# EAGLE design 6packRev4A (EAGLE 9.2.0)
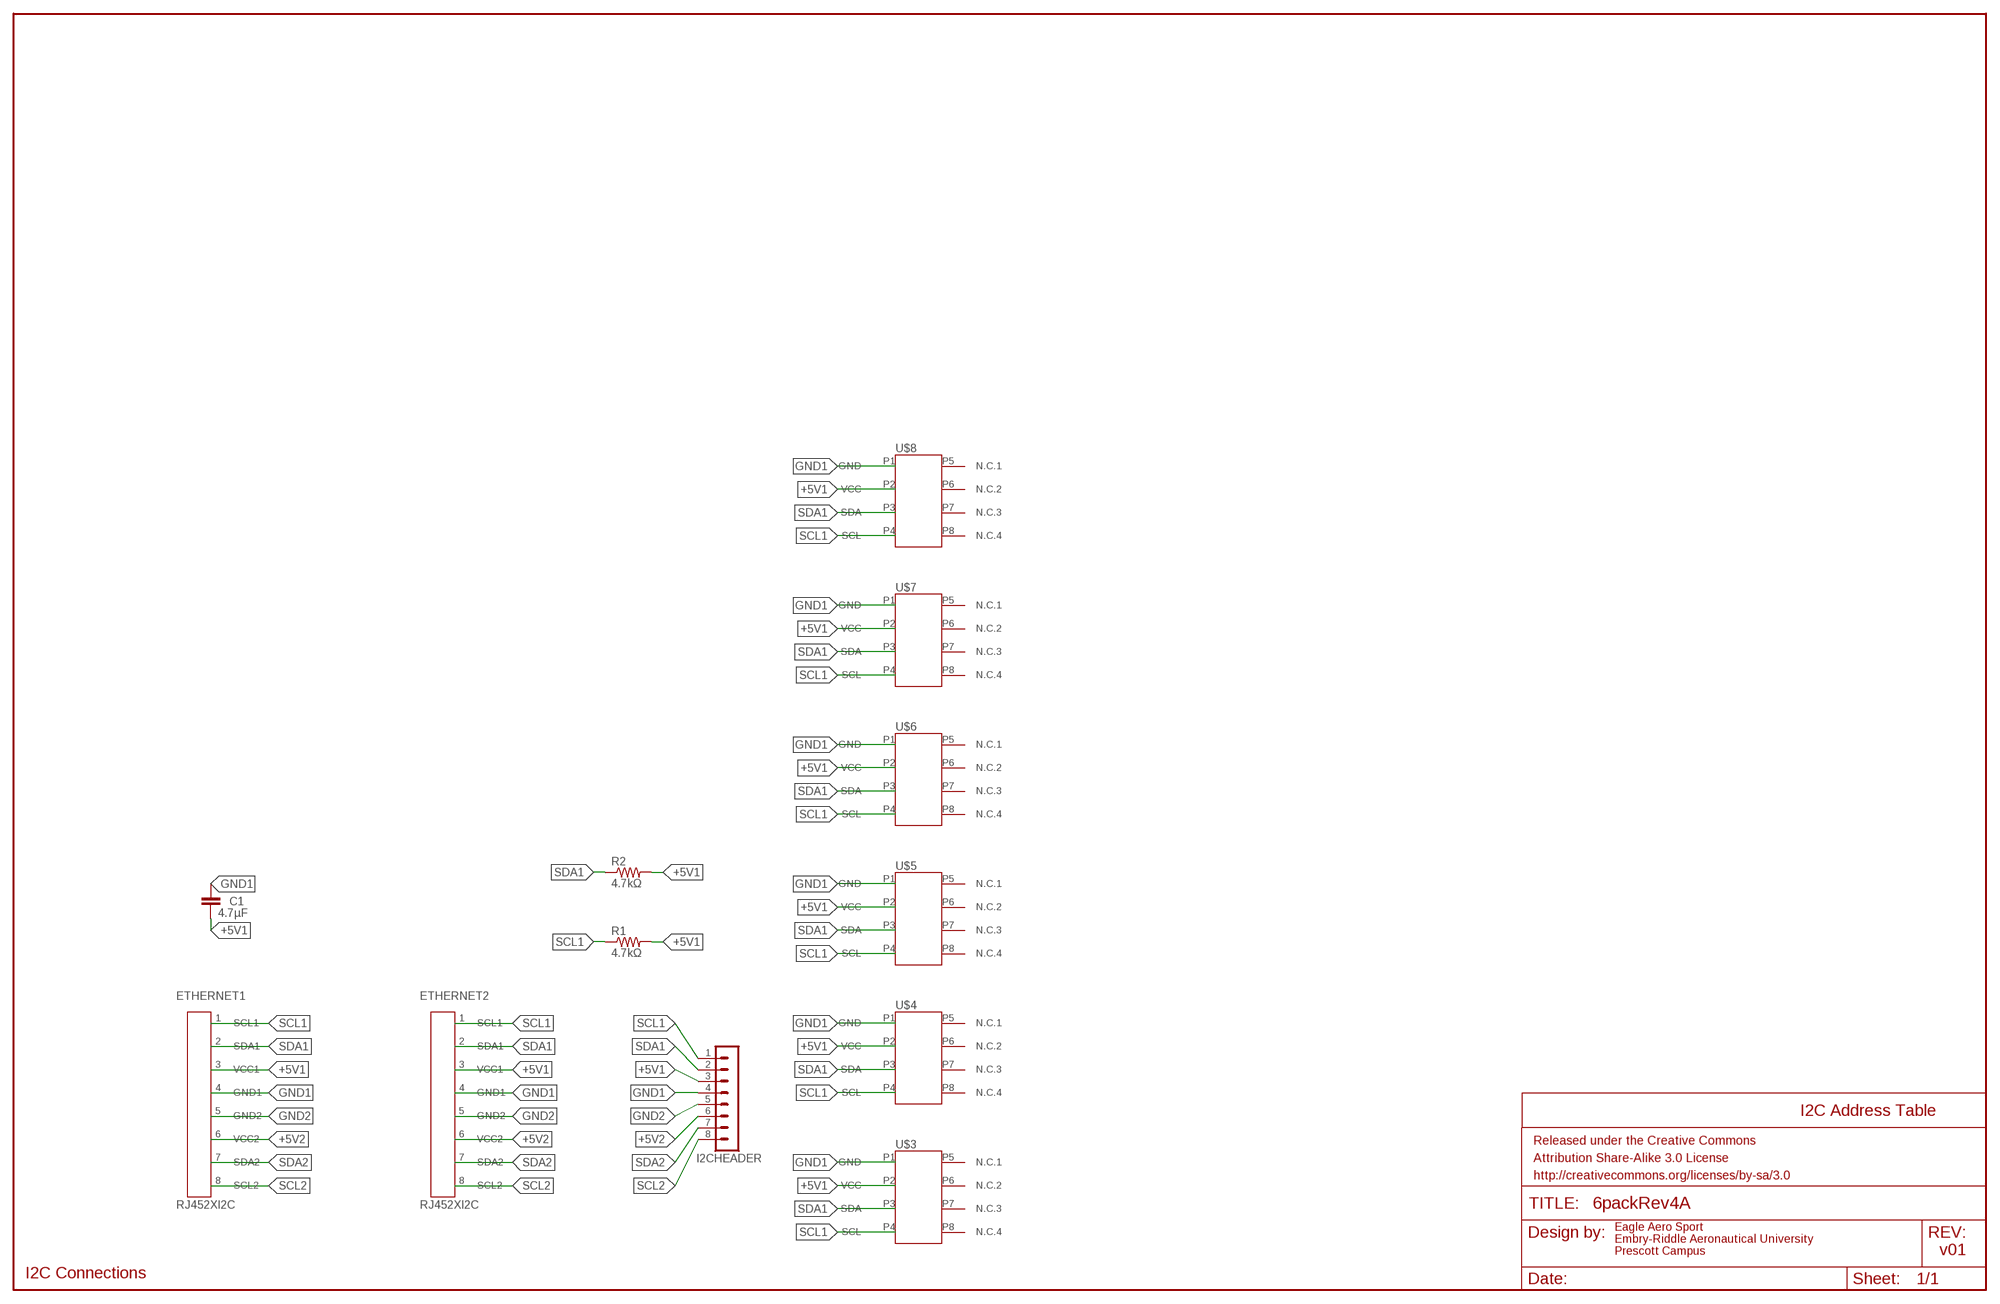
[diagram p0: schematic, sheet 1]

## Parts
C1  4.7µF  10NF-PTH-10MM-10000V-1-%  [CAP-PTH-10MM]
ETHERNET1  RJ452XI2C  [RJ45-8]
ETHERNET2  RJ452XI2C  [RJ45-8]
FRAME1  FRAME-LEDGER  [CREATIVE_COMMONS]
I2CHEADER  MA08-1  [MA08-1]
R1  4.7kΩ  R-US_0207/12  [0207/12]
R2  4.7kΩ  R-US_0207/12  [0207/12]
U$3  AMS5915  [DIP8W]
U$4  AMS5915  [DIP8W]
U$5  AMS5915  [DIP8W]
U$6  AMS5915  [DIP8W]
U$7  AMS5915  [DIP8W]
U$8  AMS5915  [DIP8W]

## Nets
+5V1 [Power]: C1.2 ETHERNET1.3(VCC1) ETHERNET2.3(VCC1) I2CHEADER.3 R1.2 R2.2 U$3.P2(VCC) U$4.P2(VCC) U$5.P2(VCC) U$6.P2(VCC) U$7.P2(VCC) U$8.P2(VCC)
+5V2 [Power]: ETHERNET1.6(VCC2) ETHERNET2.6(VCC2) I2CHEADER.6
GND1 [Power]: C1.1 ETHERNET1.4(GND1) ETHERNET2.4(GND1) I2CHEADER.4 U$3.P1(GND) U$4.P1(GND) U$5.P1(GND) U$6.P1(GND) U$7.P1(GND) U$8.P1(GND)
GND2 [Power]: ETHERNET1.5(GND2) ETHERNET2.5(GND2) I2CHEADER.5
SCL1: ETHERNET1.1(SCL1) ETHERNET2.1(SCL1) I2CHEADER.1 R1.1 U$3.P4(SCL) U$4.P4(SCL) U$5.P4(SCL) U$6.P4(SCL) U$7.P4(SCL) U$8.P4(SCL)
SCL2: ETHERNET1.8(SCL2) ETHERNET2.8(SCL2) I2CHEADER.8
SDA1: ETHERNET1.2(SDA1) ETHERNET2.2(SDA1) I2CHEADER.2 R2.1 U$3.P3(SDA) U$4.P3(SDA) U$5.P3(SDA) U$6.P3(SDA) U$7.P3(SDA) U$8.P3(SDA)
SDA2: ETHERNET1.7(SDA2) ETHERNET2.7(SDA2) I2CHEADER.7
Unconnected: U$3.P5(N.C.1) U$3.P6(N.C.2) U$3.P7(N.C.3) U$3.P8(N.C.4) U$4.P5(N.C.1) U$4.P6(N.C.2) U$4.P7(N.C.3) U$4.P8(N.C.4) U$5.P5(N.C.1) U$5.P6(N.C.2) U$5.P7(N.C.3) U$5.P8(N.C.4) U$6.P5(N.C.1) U$6.P6(N.C.2) U$6.P7(N.C.3) U$6.P8(N.C.4) U$7.P5(N.C.1) U$7.P6(N.C.2) U$7.P7(N.C.3) U$7.P8(N.C.4) U$8.P5(N.C.1) U$8.P6(N.C.2) U$8.P7(N.C.3) U$8.P8(N.C.4)

## Notes on the sheet
- I2C Address Table
- Eagle Aero Sport
  Embry-Riddle Aeronautical University
  Prescott Campus
- v01
- I2C Connections

## Library data of the parts
C1 = SparkFun-Capacitors:10NF: 0.01uF/10nF/10,000pF ceramic capacitors A capacitor is a passive two-terminal electrical component used to store electrical energy temporarily in an electric field. CAP-09321; PROD_ID: CAP-09321; VALUE: 10nF
ETHERNET1 ETHERNET2 = untitled:RJ452XI2C
FRAME1 = SparkFun-Aesthetics:FRAME-LEDGER: Schematic Frame Standard 11x14 US Ledger frame
I2CHEADER = con-lstb:MA08-1: PIN HEADER; OC_FARNELL: unknown; OC_NEWARK: unknown
R1 R2 = resistor:R-US_: RESISTOR, American symbol
U$3-U$8 = untitled:AMS5915

## Net classes
0 default: width 0.254 mm, clearance 0.254 mm
1 Power: width 0.762 mm, clearance 0.762 mm

## Board
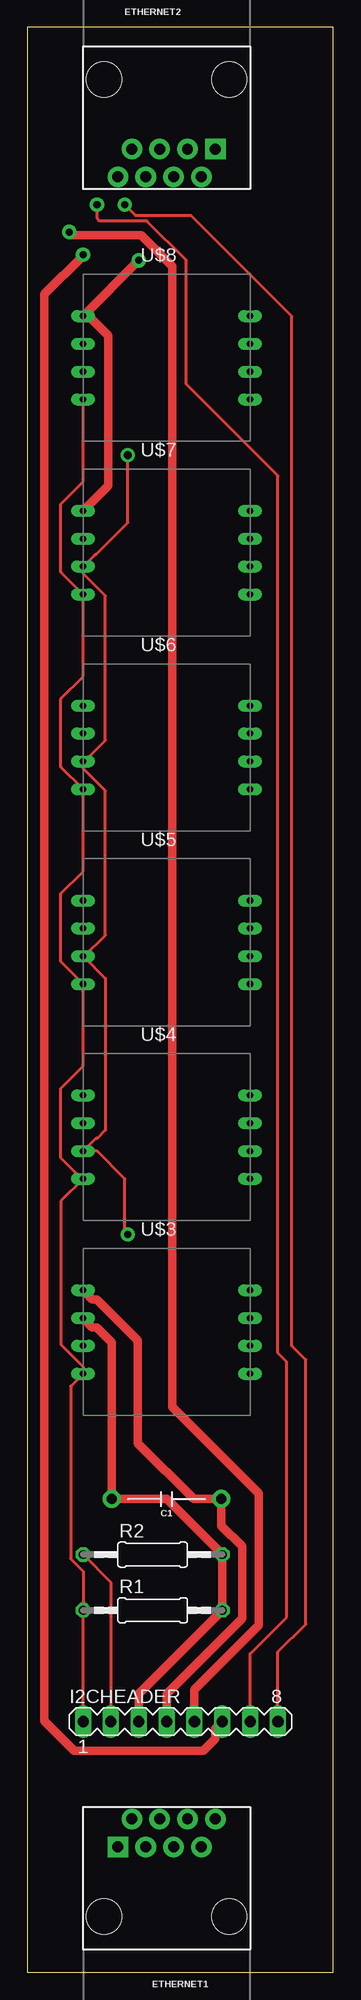
[diagram p1: board, top side]
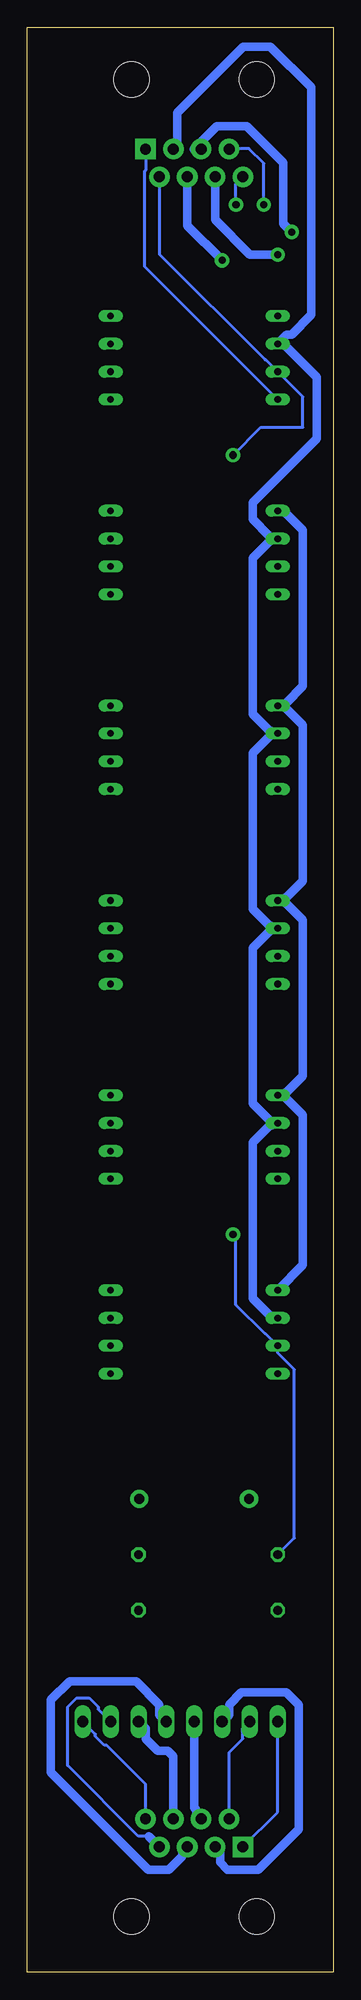
[diagram p2: board, bottom side, seen from below]

Size 27.92 x 177.47 mm. Coordinates in mm from the lower left corner, seen from the top.
Outline: 0,0 27.92,0 27.92,177.47 0,177.47 0,0
Copper layers (1*16): Top 0.035mm / dielectric 1.5mm / Bottom 0.035mm
Design rules "6packRev4A": minimum track width 6mil, minimum drill 0.35mm, track to track 0.205mm, track to pad 0.205mm, pad to pad 0.205mm, via to via 0.205mm, smd to smd 6mil, copper to edge 40mil, drill to drill 6mil, minimum pad ring 10mil, minimum via ring 8mil, stop-mask expansion 4mil, vias tented up to drill 0mil, thermal gap 10mil

### Footprints (pad centres in the part's own frame; a part is rotated, then mirrored left to right if it is on the bottom)
CAP-PTH-10MM = drill 0.9 pad 1.651: 1 -5,0; 2 5,0
RJ45-8 = drill 1 pad 1.88 square: 1 -4.445,6.35 | drill 1 pad 1.88: 2 -3.175,8.89; 3 -1.905,6.35; 4 -0.635,8.89; 5 0.635,6.35; 6 1.905,8.89; 7 3.175,6.35; 8 4.445,8.89 | hole 3.2: -5.715,0; 5.715,0
MA08-1 = drill 1.016 long: 1 -8.89,0; 2 -6.35,0; 3 -3.81,0; 4 -1.27,0; 5 1.27,0; 6 3.81,0; 7 6.35,0; 8 8.89,0
0207/12 = drill 0.813 octagon: 1 -6.35,0; 2 6.35,0
DIP8W = drill 0.6 long: P1 -7.62,3.81; P2 -7.62,1.27; P3 -7.62,-1.27; P4 -7.62,-3.81; P5 7.62,-3.81; P6 7.62,-1.27; P7 7.62,1.27; P8 7.62,3.81

### Placement (x,y rotation side)
C1  12.7,43.18 180 top
ETHERNET1  12.7,5.08 0 top
ETHERNET2  12.7,172.72 180 top
FRAME1  -77.47,62.23 0 top  (outside the outline)
I2CHEADER  13.97,22.86 0 top
R1  11.43,33.02 0 top
R2  11.43,38.1 0 top
U$3  12.7,58.42 0 top
U$4  12.7,76.2 0 top
U$5  12.7,93.98 0 top
U$6  12.7,111.76 0 top
U$7  12.7,129.54 0 top
U$8  12.7,147.32 0 top

### Tracks (layer width: path | path; a pad name or v marks a point on that pad's centre or on a via)
+5V1
  Top 0.762: I2CHEADER.3 10.16,25.4 R1.2 R2.2 12.7,43.18 C1.2 7.7,57.48 6.34,58.85 5.92,58.85 U$3.P2
  Bottom 0.762: ETHERNET1.3 10.34,10.97 10.34,10.02 9.67,9.35 6.84,9.35 3.17,13.01 3.17,24.41 4.29,25.53 8.41,25.53 9.53,24.41 9.53,23.5 I2CHEADER.3 | ETHERNET2.3 14.27,166.71 14.27,169.67 8.23,175.72 5.74,175.72 2.02,171.99 2.02,151.24 3.82,149.43 4.24,149.43 U$8.P2 4.57,148.59 1.52,145.54 1.52,139.95 7.37,134.11 7.37,132.59 5.84,131.06 U$7.P2 5.59,130.81 7.37,129.03 7.37,114.81 5.84,113.28 U$6.P2 5.59,113.03 7.37,111.25 7.37,97.03 5.84,95.5 U$5.P2 5.59,95.25 7.37,93.47 7.37,79.25 5.59,77.47 U$4.P2 5.84,77.22 7.37,75.69 7.37,61.47 5.59,59.69 U$3.P2
+5V2  (via drill 0.65 pad 1.3)
  Top 0.762: I2CHEADER.6 17.14,22.23 17.14,21.31 16.03,20.19 4.29,20.19 1.56,22.93 1.56,153.1 5.08,156.62 v5.08,156.73
  Bottom 0.762: ETHERNET1.6 14.61,19.68 15.11,20.19 16.03,20.19 17.14,21.31 17.14,22.23 I2CHEADER.6 | v5.08,156.73 7.62,156.73 10.79,159.91 ETHERNET2.6
GND1  (via drill 0.65 pad 1.3)
  Top 0.762: v10.16,156.21 U$8.P1 5.59,151.13 7.37,149.35 7.37,135.64 U$7.P1 | I2CHEADER.4 12.7,25.39 19.58,32.27 19.58,38.85 17.7,40.73 C1.1 15.16,43.18 10.08,48.26 10.08,57.64 6.34,61.39 5.92,61.39 U$3.P1
  Bottom 0.762: ETHERNET1.4 12.52,14.43 12.52,14.83 12.7,15.01 I2CHEADER.4 | v10.16,156.21 13.34,159.38 ETHERNET2.4 | U$3.P1 2.79,64.52 2.79,78.23 4.57,80.01 U$4.P1 4.32,80.26 2.79,81.79 2.79,96.01 4.57,97.79 U$5.P1 4.32,98.04 2.79,99.57 2.79,113.79 4.57,115.57 U$6.P1 4.32,115.82 2.79,117.35 2.79,131.57 4.57,133.35 U$7.P1
GND2  (via drill 0.65 pad 1.3)
  Top 0.762: I2CHEADER.5 15.24,25.77 21.11,31.64 21.11,43.69 13.22,51.58 13.22,155.68 10.38,158.53 4.03,158.53 3.81,158.75 v3.81,158.79
  Bottom 0.762: ETHERNET1.5 13.79,10.97 13.79,10.57 15.01,9.35 16.91,9.35 25.78,18.22 25.78,24.83 24.07,26.54 18.01,26.54 15.88,24.41 15.88,23.5 I2CHEADER.5 | 3.81,158.75 v3.81,158.79 4.56,159.54 4.56,165.1 7.91,168.45 10.66,168.45 12.74,166.37 ETHERNET2.5
SCL1
  Top 0.254: I2CHEADER.1 R1.1 5.08,36.58 3.94,37.72 3.94,53.47 U$3.P4 5.08,55.24 3.05,57.28 3.05,70.36 U$4.P4 4.95,72.39 3.05,74.3 3.05,80.64 5.08,82.68 U$5.P4 3.05,92.2 3.05,98.42 5.08,100.46 U$6.P4 3.05,109.98 3.05,116.2 5.08,118.24 U$7.P4 3.05,127.76 3.05,133.99 5.08,136.02 U$8.P4
  Bottom 0.254: ETHERNET1.1 5.08,14.61 I2CHEADER.1 | ETHERNET2.1 17.14,164.43 17.2,164.38 17.2,155.63 U$8.P4
SCL2  (via drill 0.65 pad 1.3)
  Top 0.254: I2CHEADER.8 22.86,29.21 25.4,31.75 25.4,55.88 24.13,57.15 24.13,151.1 14.93,160.3 9.88,160.3 v8.89,161.29
  Bottom 0.254: ETHERNET1.8 17.14,17.14 20.7,20.7 20.9,20.7 21.72,21.52 21.72,21.72 I2CHEADER.8 | v8.89,161.29 8.89,163.19 ETHERNET2.8
SDA1  (via drill 0.65 pad 1.3, 0.7 pad 1.3)
  Top 0.254: I2CHEADER.2 7.62,35.56 R2.1 | 5.08,110.36 5.08,109.86 7.11,107.82 7.11,94.61 5.21,92.71 U$5.P3 7.11,90.68 7.11,76.83 6.35,76.07 6.22,76.07 U$4.P3 6.35,74.93 8.89,72.39 8.89,67.58 v9.16,67.31 | 5.08,110.36 7.11,112.39 7.11,125.6 5.08,127.64 U$7.P3 6.18,129.37 6.23,129.37 9.16,132.29 v9.16,138.43 | 5.08,110.36 U$6.P3
  Bottom 0.254: I2CHEADER.2 8.26,22.23 8.26,21.31 9.53,20.04 ETHERNET1.2 | ETHERNET2.2 15.88,156.79 6.23,147.15 6.18,147.15 U$8.P3 2.79,143.76 2.79,140.97 6.62,140.97 v9.16,138.43 | R2.1 3.56,39.62 3.56,54.99 5.08,56.52 U$3.P3 6.18,58.25 6.23,58.25 8.89,60.91 8.89,67.31 v9.16,67.31
SDA2  (via drill 0.65 pad 1.3)
  Top 0.254: I2CHEADER.7 20.32,29.06 23.65,32.39 23.65,55.7 22.86,56.49 22.86,136.55 14.49,144.92 14.49,156.21 10.91,159.8 6.57,159.8 6.35,160.02 v6.35,161.29
  Bottom 0.254: 16.84,12.39 17.8,12.39 24.26,18.86 24.26,24.2 23.44,25.02 22.28,25.02 21.46,24.2 21.46,24 I2CHEADER.7 | ETHERNET2.7 9.47,166.42 7.71,166.42 6.35,165.06 v6.35,161.29
  Bottom 0.762: ETHERNET1.7 16.84,12.39